# Altium schematic sheet FX2LP.SchDoc
size A4
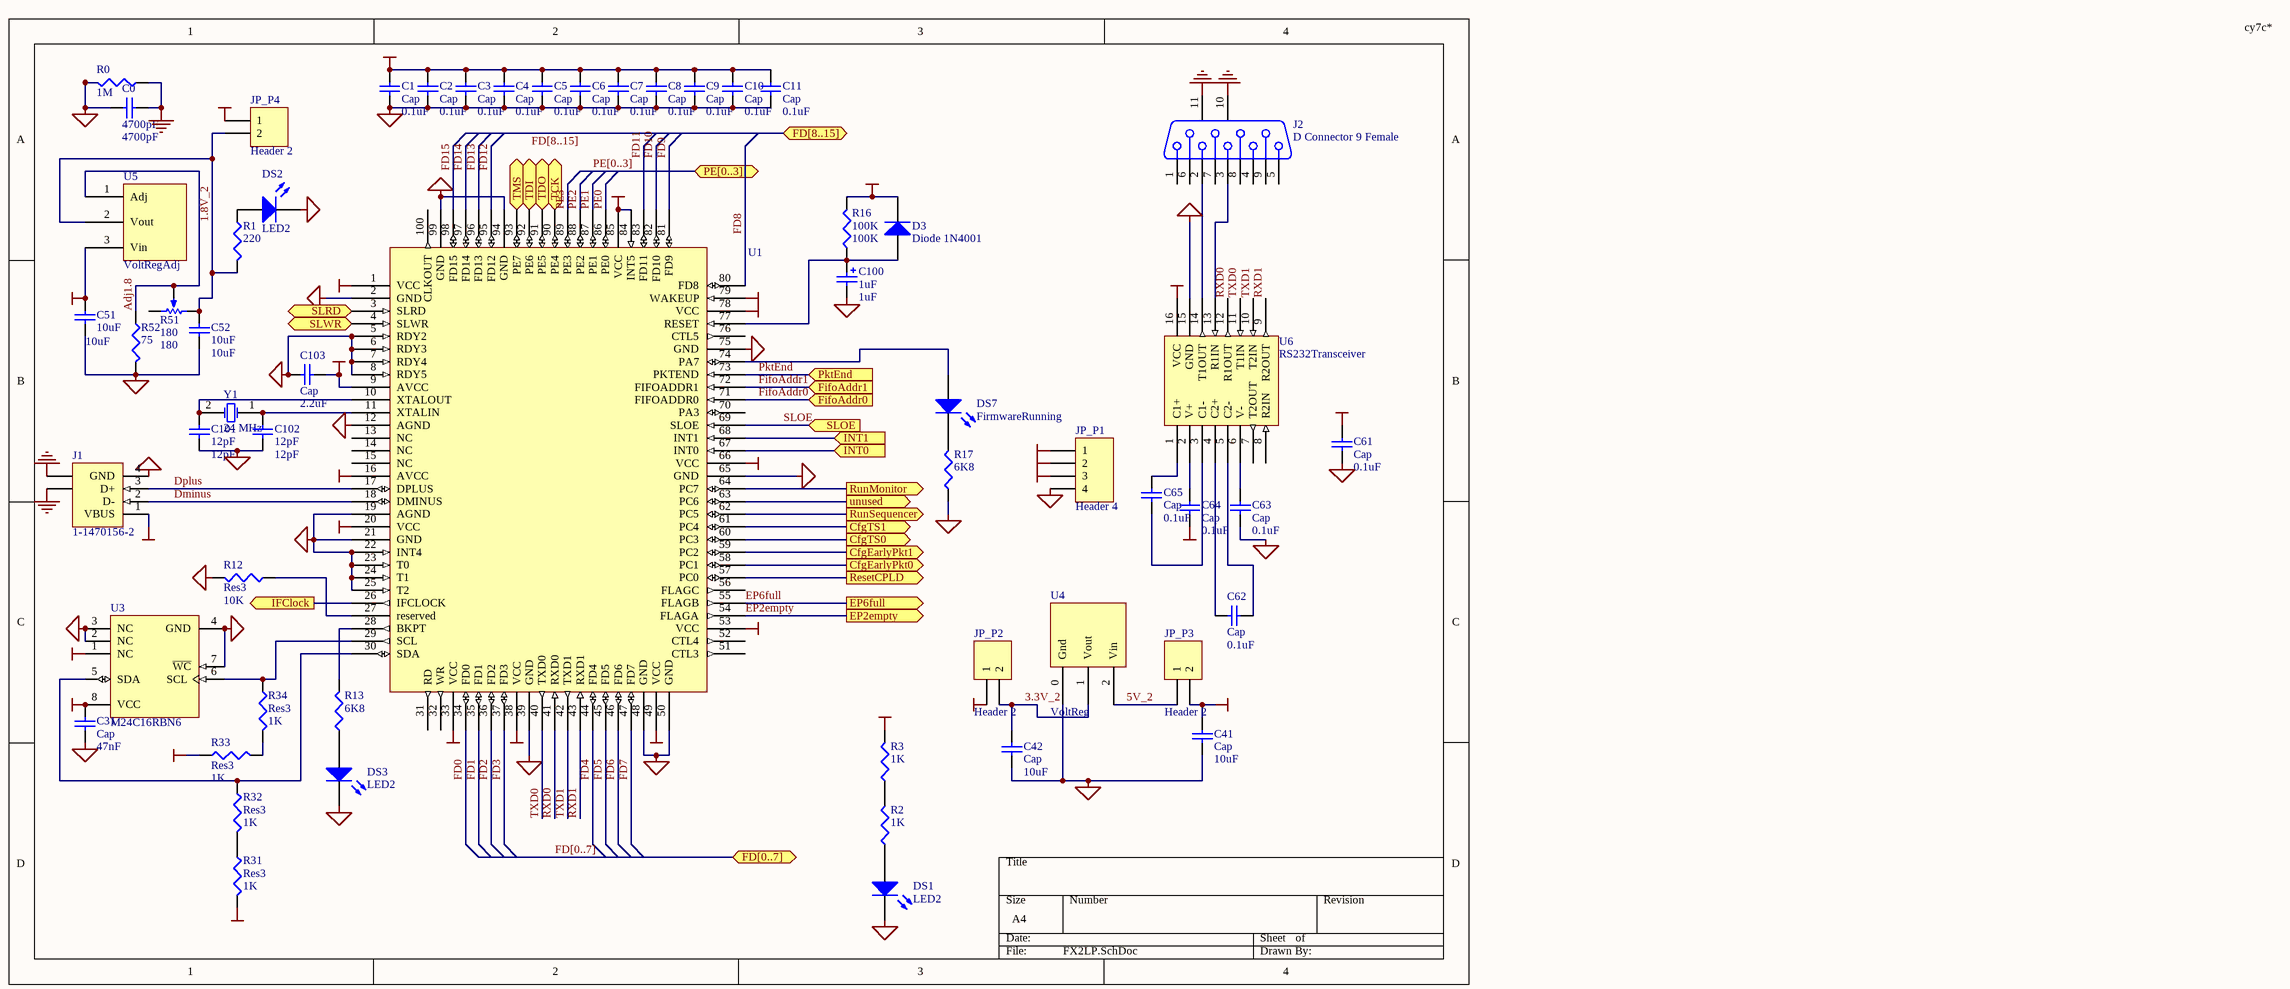
[diagram p0: FX2LP.SchDoc]

## Parts
C0  4700pF  [CAP 10]
C1  Cap  value 0.1uF  [CAP 10]
C2  Cap  value 0.1uF  [CAP 10]
C3  Cap  value 0.1uF  [CAP 10]
C4  Cap  value 0.1uF  [CAP 10]
C5  Cap  value 0.1uF  [CAP 10]
C6  Cap  value 0.1uF  [CAP 10]
C7  Cap  value 0.1uF  [CAP 10]
C8  Cap  value 0.1uF  [CAP 10]
C9  Cap  value 0.1uF  [CAP 10]
C10  Cap  value 0.1uF  [CAP 10]
C11  Cap  value 0.1uF  [CAP 10]
C31  Cap  value 47nF  [CAP 10]
C41  Cap  value 10uF  [1206(2)]
C42  Cap  value 10uF  [1206(2)]
C51  10uF  [1206(2)]
C52  10uF  [1206(2)]
C61  Cap  value 0.1uF  [CAP 10]
C62  Cap  value 0.1uF  [CAP 10]
C63  Cap  value 0.1uF  [CAP 10]
C64  Cap  value 0.1uF  [CAP 10]
C65  Cap  value 0.1uF  [CAP 10]
C100  1uF  [CAP 10]
C101  12pF  [CAP 10]
C102  12pF  [CAP 10]
C103  Cap  value 2.2uF  [1206(2)]
D3  Diode 1N4001  [DIO10.46-5.3x2.8]
DS1  LED2  [LED]
DS2  LED2  [LED]
DS3  LED2  [LED]
DS7  FirmwareRunning  [LED]
J1  1-1470156-2  [1-1470156]
J2  D Connector 9 Female  [DSUB1.385-2H9]
JP_P1  Header 4  [HDR1X4]
JP_P2  Header 2  [HDR1X2]
JP_P3  Header 2  [SIP-2]
JP_P4  Header 2  [SIP-2]
R0  value 1M  [C1608-0603]  (hidden comment: Res3)
R1  value 220  [C1608-0603]  (hidden comment: Res3)
R2  value 1K  [C1608-0603]  (hidden comment: Res3)
R3  value 1K  [C1608-0603]  (hidden comment: Res3)
R12  Res3  value 10K  [C1608-0603]
R13  value 6K8  [C1608-0603]  (hidden comment: Res3)
R16  100K  [C1608-0603]
R17  value 6K8  [C1608-0603]  (hidden comment: Res3)
R31  Res3  value 1K  [C1608-0603]
R32  Res3  value 1K  [C1608-0603]
R33  Res3  value 1K  [C1608-0603]
R34  Res3  value 1K  [C1608-0603]
R51  180  [Pot]
R52  value 75  [1206(2)]  (hidden comment: Res3)
U1  FX2LP  [R-QFP14x20-G100/X.4N]  (value not drawn)
U3  M24C16RBN6  [PSDIP8A]
U4  VoltReg  [TO-220]
U5  VoltRegAdj  [TO-220]
U6  RS232Transceiver  [TSSO5x6-G16]
Y1  24 MHz  [Cristal]

## Ports
CfgEarlyPkt0 (out), CfgEarlyPkt1 (out), CfgTS0 (out), CfgTS1 (out), EP2empty (out), EP6full (out), FD[0..7] (bidir), FD[8..15] (bidir), FifoAddr0 (in), FifoAddr1 (in), IFClock (out), INT0 (in), INT1 (in), PE[0..3] (bidir), PktEnd (in), ResetCPLD (out), RunMonitor (out), RunSequencer (out), SLOE (in), SLRD (in), SLWR (in), TCK (bidir), TDI (bidir), TDO (bidir), TMS (bidir), unused (out)

## Nets
1.8V: JP_P4.1
1.8V_2: C52.1 JP_P1.3 JP_P4.2 R1.2 R51.1(TOP) U5.2(Vout)
3.3V: C1.2 C2.2 C3.2 C4.2 C5.2 C6.2 C7.2 C8.2 C9.2 C10.2 C11.2 C31.2 C51.1 C61.2 C64.1 C103.1 D3.2(K) JP_P2.1 R16.2 R31.2 R33.1 U1.1(VCC) U1.9(AVCC) U1.16(AVCC) U1.20(VCC) U1.33(VCC) U1.38(VCC) U1.49(VCC) U1.53(VCC) U1.66(VCC) U1.78(VCC) U1.79(WAKEUP) U1.84(INT5) U1.85(VCC) U3.1(NC) U3.8(VCC) U5.3(Vin) U6.16(VCC)
3.3V_2: C42.1 JP_P1.2 JP_P2.2 R3.2 U4.1(Vout)
5V: C41.1 J1.1(VBUS) JP_P1.1 JP_P3.2
AGND: C0.2 J1.5(SHLD) J1.6(SHLD) J2.10(MH1) J2.11(MH2) R0.1
GND: C0.1 C1.1 C2.1 C3.1 C4.1 C5.1 C6.1 C7.1 C8.1 C9.1 C10.1 C11.1 C31.1 C41.2 C42.2 C51.2 C52.2 C61.1 C63.1 C100.2 C101.2 C102.2 C103.2 DS1.2(K) DS2.2(K) DS3.2(K) J1.4(GND) JP_P1.4 R0.2 R12.2 R17.1 R52.2 U1.2(GND) U1.5(RDY2) U1.6(RDY3) U1.7(RDY4) U1.8(RDY5) U1.12(AGND) U1.19(AGND) U1.21(GND) U1.22(INT4) U1.23(T0) U1.24(T1) U1.25(T2) U1.39(GND) U1.48(GND) U1.50(GND) U1.65(GND) U1.75(GND) U1.94(GND) U1.99(GND) U3.2(NC) U3.3(NC) U3.4(GND) U3.7(~{WC}) U4.0(Gnd) U6.15(GND)
5V_2: JP_P3.1 U4.2(Vin)
Adj1.8: R51.3(TAP) R52.1 U5.1(Adj)
CfgEarlyPkt0: U1.58(PC1) ; port CfgEarlyPkt0
CfgEarlyPkt1: U1.59(PC2) ; port CfgEarlyPkt1
CfgTS0: U1.60(PC3) ; port CfgTS0
CfgTS1: U1.61(PC4) ; port CfgTS1
Dminus: J1.2(D-) U1.18(DMINUS)
Dplus: J1.3(D+) U1.17(DPLUS)
EP2empty: U1.54(FLAGA) ; port EP2empty
EP6full: U1.55(FLAGB) ; port EP6full
FD0: U1.34(FD0)
FD1: U1.35(FD1)
FD2: U1.36(FD2)
FD3: U1.37(FD3)
FD4: U1.44(FD4)
FD5: U1.45(FD5)
FD6: U1.46(FD6)
FD7: U1.47(FD7)
FD8: U1.80(FD8)
FD9: U1.81(FD9)
FD10: U1.82(FD10)
FD11: U1.83(FD11)
FD12: U1.95(FD12)
FD13: U1.96(FD13)
FD14: U1.97(FD14)
FD15: U1.98(FD15)
FifoAddr0: U1.71(FIFOADDR0) ; port FifoAddr0
FifoAddr1: U1.72(FIFOADDR1) ; port FifoAddr1
IFClock: U1.26(IFCLOCK) ; port IFClock
INT0: U1.67(INT0) ; port INT0
INT1: U1.68(INT1) ; port INT1
PE0: U1.86(PE0)
PE1: U1.87(PE1)
PE2: U1.88(PE2)
PE3: U1.89(PE3)
PktEnd: U1.73(PKTEND) ; port PktEnd
ResetCPLD: U1.57(PC0) ; port ResetCPLD
RunMonitor: U1.64(PC7) ; port RunMonitor
RunSequencer: U1.62(PC5) ; port RunSequencer
RXD0: U1.41(RXD0) U6.12(R1OUT)
RXD1: U1.43(RXD1) U6.9(R2OUT)
SLOE: U1.69(SLOE) ; port SLOE
SLRD: U1.3(SLRD) ; port SLRD
SLWR: U1.4(SLWR) ; port SLWR
TCK: U1.90(PE4) ; port TCK
TDI: U1.92(PE6) ; port TDI
TDO: U1.91(PE5) ; port TDO
TMS: U1.93(PE7) ; port TMS
TXD0: U1.40(TXD0) U6.11(T1IN)
TXD1: U1.42(TXD1) U6.10(T2IN)
unused: U1.63(PC6) ; port unused
NetC62_1: C62.1 U6.5(C2-)
NetC62_2: C62.2 U6.4(C2+)
NetC63_2: C63.2 U6.6(V-)
NetC64_2: C64.2 U6.2(V+)
NetC65_1: C65.1 U6.3(C1-)
NetC65_2: C65.2 U6.1(C1+)
NetC100_1: C100.1 D3.1(A) R16.1 U1.77(RESET)
NetC101_1: C101.1 U1.10(XTALOUT) Y1.2(OSC2)
NetC102_1: C102.1 U1.11(XTALIN) Y1.1(OSC1)
NetDS1_1: DS1.1(A) R2.1
NetDS2_1: DS2.1(A) R1.1
NetDS3_1: DS3.1(A) R13.1
NetDS7_1: DS7.1(A) U1.74(PA7)
NetDS7_2: DS7.2(K) R17.2
NetJ2_2: J2.2 U6.14(T1OUT)
NetJ2_3: J2.3 U6.13(R1IN)
NetR2_2: R2.2 R3.1
NetR12_1: R12.1 U1.27(reserved)
NetR13_2: R13.2 U1.28(BKPT)
NetR31_1: R31.1 R32.2
NetR32_1: R32.1 U1.30(SDA) U3.5(SDA)
NetR33_2: R33.2 R34.2
NetR34_1: R34.1 U1.29(SCL) U3.6(SCL)

Not connected (* = marked no-connect by the designer): J2 1 4 5 6 7 8 9; R51 2(BOT); U1 13(NC) 14(NC) 15(NC) 31(RD) 32(WR) 51(CTL3) 52(CTL4) 56(FLAGC) 70(PA3) 76(CTL5) 100(CLKOUT); U6 7(T2OUT) 8(R2IN)

## Buses and harness runs
bus FD[0..7] = port FD[0..7]
bus FD[8..15] = port FD[8..15]
bus PE[0..3] = port PE[0..3]

## Notes on the sheet
- cy7c*

## Library data of the parts
C0-C11 C31 C41 C42 C51 C52 C61-C65 C101-C103 = Cap: Capacitor; Published: 8-Jun-2000; Revision: July-2002: Re-released for DXP Platform.; Publisher: Altium Limited
  C0: Value: 4700pF
  C51 C52: Value: 10uF
  C101 C102: Value: 12pF
C100 = Cap Pol3: Polarized Capacitor (Surface Mount); Published: 8-Jun-2000; Revision: July-2002: Re-released for DXP Platform.; Publisher: Altium Limited; Value: 1uF
D3 = Diode 1N4001: 1 Amp General Purpose Rectifier; Code - JEDEC: DO-204-AL; Revision 1: 11-Jul-2000: SIM Model Added.; Revision 2: 17-Jul-2002: Re-released for DXP Platform.; Package Information: Latest Revision: Aug-1999; Published: 8-Jun-2000; Publisher: Altium Limited; Datasheet: Latest Revision: 1998; Package Reference: DO-41
DS1-DS3 DS7 = LED2: Typical RED, GREEN, YELLOW, AMBER GaAs LED; pin to pad: 1>A 2>K; Published: 8-Jun-2000; Revision: July-2002: Re-released for DXP Platform.; Publisher: Altium Limited
J1 = 1-1470156-2: USB 1.1, Right Angle, Thru-Hole, B Type, Receptacle, 4 Position, Black; ContactMaterial: Phosphor Bronze; ContactPlating: Gold over Nickel; TerminationLength: 3.00mm [0.118in.]; PCB_Layout: Complies with manufacturer's recommendation.; DrillSize: Corresponds to nominal value.; PanelGround: Without; Published: 15-Jul-2004; DatasheetDocument: 02-Jun-2001; PackageDocument: 02-Jun-2001; PackageReference: 1-1470156; Publisher: Altium Limited; HousingMaterial: Glass-Filled Thermoplastic
J2 = D Connector 9: Receptacle Assembly, 9 Position, Right Angle; Package Information: Latest Revision: O; Positions: 9; Published: 15-Jun-2001; Revision: 17-Jul-2002: Re-released for DXP Platform.; Datasheet: (1-Sep-1999); Package Reference: 788750; Publisher: Altium Limited; Orientation: Right Angle; Gender: Receptacle
JP_P1 = Header 4: Header, 4-Pin; Revision: 17-Jul-2002: Re-released for DXP Platform.; Publisher: Altium Limited
JP_P2-JP_P4 = Header 2: Header, 2-Pin; Revision: 17-Jul-2002: Re-released for DXP Platform.; Publisher: Altium Limited
R0-R3 R12 R13 R16 R17 R31-R34 R52 = Res3: Resistor; Published: 8-Jun-2000; Revision: July-2002: Re-released for DXP Platform.; Publisher: Altium Limited
  R16: Value: 100K
R51 = RPot: Potentiometer; Set Position: 0.5; Published: 8-Jun-2000; Revision: July-2002: Re-released for DXP Platform.; Publisher: Altium Limited; Value: 180
U1 = FX2LP: Cypress FX2LP 100 pin
U3 = M24C16RBN6: 16Kbit Serial I²C Bus EEPROM; Package Information: Latest Revision: Jun-1998; Published: 24-Aug-2001; Revision: 17-Jul-2002: Re-released for DXP Platform.; Datasheet: Latest Revision: Sep-1999; Package Reference: PSDIP8A; Publisher: Altium Limited
U4 = VoltReg: 5 to 3.3 volts regulator; pin to pad: 0>1 1>2 2>3
U6 = RS232Transceiver: Analog Devices RS232 Transceiver
Y1 = XTAL: Crystal Oscillator; Published: 8-Jun-2000; Revision: July-2002: Re-released for DXP Platform.; Publisher: Altium Limited; Value: 24 MHz